# Altium schematic sheet Pasa Banda Superior.SchDoc
size A3
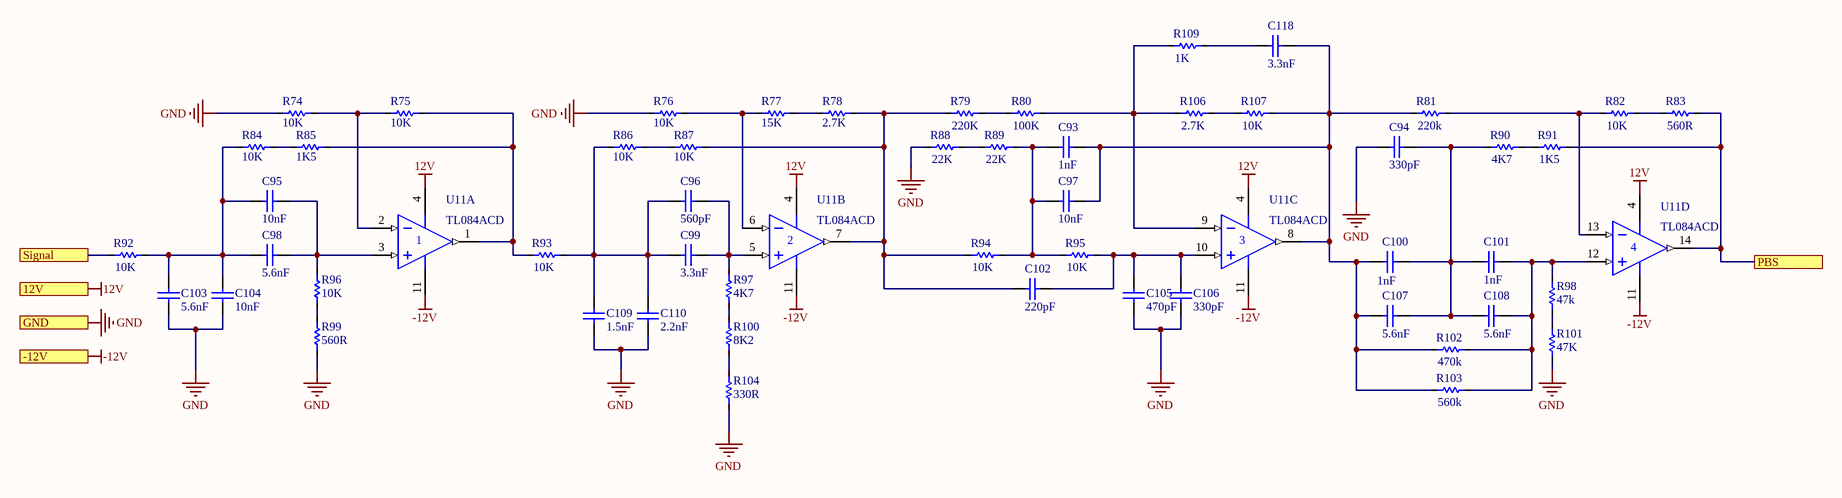
[diagram p0: Pasa Banda Superior.SchDoc]

## Parts
C93  VALOR: 1nF  [CAP DISCO 200mil]  (hidden comment: Cap Ceramico Disco)
C94  VALOR: 330pF  [cap 10]  (hidden comment: Cap Ceramico Disco)
C95  VALOR: 10nF  [cap 10]  (hidden comment: Cap Ceramico Disco)
C96  VALOR: 560pF  [CAP DISCO 200mil]  (hidden comment: Cap Ceramico Disco)
C97  VALOR: 10nF  [CAP DISCO 200mil]  (hidden comment: Cap Ceramico Disco)
C98  VALOR: 5.6nF  [CAP DISCO 200mil]  (hidden comment: Cap Ceramico Disco)
C99  VALOR: 3.3nF  [CAP DISCO 200mil]  (hidden comment: Cap Ceramico Disco)
C100  VALOR: 1nF  [CAP DISCO 200mil]  (hidden comment: Cap Ceramico Disco)
C101  VALOR: 1nF  [CAP DISCO 200mil]  (hidden comment: Cap Ceramico Disco)
C102  VALOR: 220pF  [CAP DISCO 200mil]  (hidden comment: Cap Ceramico Disco)
C103  VALOR: 5.6nF  [CAP DISCO 200mil]  (hidden comment: Cap Ceramico Disco)
C104  VALOR: 10nF  [cap 10]  (hidden comment: Cap Ceramico Disco)
C105  VALOR: 470pF  [cap 10]  (hidden comment: Cap Ceramico Disco)
C106  VALOR: 330pF  [CAP DISCO 150mil]  (hidden comment: Cap Ceramico Disco)
C107  VALOR: 5.6nF  [CAP DISCO 200mil]  (hidden comment: Cap Ceramico Disco)
C108  VALOR: 5.6nF  [CAP DISCO 200mil]  (hidden comment: Cap Ceramico Disco)
C109  VALOR: 1.5nF  [cap 10]  (hidden comment: Cap Ceramico Disco)
C110  VALOR: 2.2nF  [cap 10]  (hidden comment: Cap Ceramico Disco)
C118  VALOR: 3.3nF  [CAP DISCO 200mil]  (hidden comment: Cap Ceramico Disco)
R74  VALOR: 10K  [1206 resistor]  (hidden comment: Res SMD)
R75  VALOR: 10K  [1206 resistor]  (hidden comment: Res SMD)
R76  VALOR: 10K  [1206 resistor]  (hidden comment: Res SMD)
R77  VALOR: 15K  [1206 resistor]  (hidden comment: Res SMD)
R78  VALOR: 2.7K  [1206 resistor]  (hidden comment: Res SMD)
R79  VALOR: 220K  [RES AXIAL 400mil]  (hidden comment: Res SMD)
R80  VALOR: 100K  [RES AXIAL 400mil]  (hidden comment: Res SMD)
R81  VALOR: 220k  [RES AXIAL 400mil]  (hidden comment: Res SMD)
R82  VALOR: 10K  [1206 resistor]  (hidden comment: Res SMD)
R83  VALOR: 560R  [1206 resistor]  (hidden comment: Res SMD)
R84  VALOR: 10K  [1206 resistor]  (hidden comment: Res SMD)
R85  VALOR: 1K5  [1206 resistor]  (hidden comment: Res SMD)
R86  VALOR: 10K  [1206 resistor]  (hidden comment: Res SMD)
R87  VALOR: 10K  [1206 resistor]  (hidden comment: Res SMD)
R88  VALOR: 22K  [1206 resistor]  (hidden comment: Res SMD)
R89  VALOR: 22K  [1206 resistor]  (hidden comment: Res SMD)
R90  VALOR: 4K7  [1206 resistor]  (hidden comment: Res SMD)
R91  VALOR: 1K5  [1206 resistor]  (hidden comment: Res SMD)
R92  VALOR: 10K  [1206 resistor]  (hidden comment: Res SMD)
R93  VALOR: 10K  [1206 resistor]  (hidden comment: Res SMD)
R94  VALOR: 10K  [1206 resistor]  (hidden comment: Res SMD)
R95  VALOR: 10K  [1206 resistor]  (hidden comment: Res SMD)
R96  VALOR: 10K  [1206 resistor]  (hidden comment: Res SMD)
R97  VALOR: 4K7  [1206 resistor]  (hidden comment: Res SMD)
R98  VALOR: 47k  [RES AXIAL 400mil]  (hidden comment: Res SMD)
R99  VALOR: 560R  [1206 resistor]  (hidden comment: Res SMD)
R100  VALOR: 8K2  [1206 resistor]  (hidden comment: Res SMD)
R101  VALOR: 47K  [RES AXIAL 400mil]  (hidden comment: Res SMD)
R102  VALOR: 470k  [RES AXIAL 400mil]  (hidden comment: Res SMD)
R103  VALOR: 560k  [RES AXIAL 400mil]  (hidden comment: Res SMD)
R104  VALOR: 330R  [1206 resistor]  (hidden comment: Res SMD)
R106  VALOR: 2.7K  [1206 resistor]  (hidden comment: Res SMD)
R107  VALOR: 10K  [1206 resistor]  (hidden comment: Res SMD)
R109  VALOR: 1K  [1206 resistor]  (hidden comment: Res SMD)
U11  TL084ACD  [751A-02_N]  (parts A,B,C,D of 4)

## Ports
12V, -12V, GND, PBS, Signal

## Nets
12V: U11.4(V+) ; port 12V
-12V: U11.11(V-) ; port -12V
GND: C94.2 C103.1 C104.1 C105.2 C106.2 C109.1 C110.1 R74.2 R76.2 R88.1 R99.1 R101.1 R104.1 ; port GND
PBS: R83.2 R91.2 U11.14(OUT) ; port PBS
Signal: R92.1 ; port Signal
NetC93_1: C93.1 C97.1 C100.2 C107.2 C118.1 R81.1 R102.1 R103.1 R107.1 U11.8(OUT)
NetC93_2: C93.2 C97.2 R89.2 R94.2 R95.1
NetC94_1: C94.1 C100.1 C101.2 C107.1 C108.2 R90.1
NetC95_1: C95.1 C98.1 R96.2 U11.3(IN+)
NetC95_2: C95.2 C98.2 C103.2 C104.2 R84.2 R92.2
NetC96_1: C96.1 C99.1 R97.2 U11.5(IN+)
NetC96_2: C96.2 C99.2 C109.2 C110.2 R86.2 R93.2
NetC101_1: C101.1 C108.1 R98.2 R102.2 R103.2 U11.12(IN+)
NetC102_1: C102.1 C105.1 C106.1 R95.2 U11.10(IN+)
NetC102_2: C102.2 R78.1 R79.1 R87.1 R94.1 U11.7(OUT)
NetC118_2: C118.2 R109.2
NetR74_1: R74.1 R75.2 U11.2(IN-)
NetR75_1: R75.1 R85.1 R93.1 U11.1(OUT)
NetR76_1: R76.1 R77.2 U11.6(IN-)
NetR77_1: R77.1 R78.2
NetR79_2: R79.2 R80.1
NetR80_2: R80.2 R106.2 R109.1 U11.9(IN-)
NetR81_2: R81.2 R82.1 U11.13(IN-)
NetR82_2: R82.2 R83.1
NetR84_1: R84.1 R85.2
NetR86_1: R86.1 R87.2
NetR88_2: R88.2 R89.1
NetR90_2: R90.2 R91.1
NetR96_1: R96.1 R99.2
NetR97_1: R97.1 R100.2
NetR98_1: R98.1 R101.2
NetR100_1: R100.1 R104.2
NetR106_1: R106.1 R107.2

## Library data of the parts
C93-C110 C118 = Cap Ceramico Disco: Capacitor Ceramico de Insercion; FABRICANTE: Generico; CODIGO STI: *; PROVEEDOR: *
U11 = TL084ACD: JFET-Input Operational Amplifier; Published: 17-Jul-2002; LatestRevisionDate: 13-Apr-2006; LatestRevisionNote: IPC-7351 Footprint Added.; DatasheetVersion: 1988; PackageVersion: 1991; PackageReference: 751A-02; Publisher: Altium Limited; PackageDescription: 14-Pin Small Outline Integrated Circuit 1.27 mm Pitch; Code_IPC: SOIC127P600-14; ComponentLink1Description: Manufacturer Link; ComponentLink1URL: http://www.onsemi.com/site/products/parametrics/0,4446,251,00.html
R74-R104 R106 R107 R109 = Res SMD: CODIGO STI: *; PROVEEDOR: *; FABRICANTE: *; PART NUMBER: *